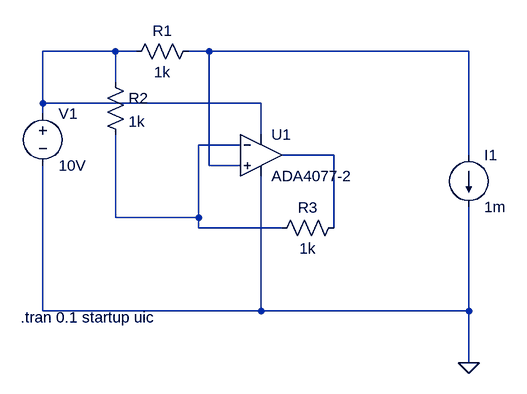
[diagram p0: schematic Draft7.asc]
Draft7.asc, the LTspice schematic file:
Version 4
SHEET 1 880 680
WIRE 160 32 48 32
WIRE 192 32 160 32
WIRE 304 32 272 32
WIRE 704 32 304 32
WIRE 160 80 160 32
WIRE 48 112 48 32
WIRE 384 112 48 112
WIRE 48 128 48 112
WIRE 384 160 384 112
WIRE 352 176 288 176
WIRE 496 192 416 192
WIRE 704 192 704 32
WIRE 304 208 304 32
WIRE 352 208 304 208
WIRE 160 288 160 160
WIRE 288 288 288 176
WIRE 288 288 160 288
WIRE 288 304 288 288
WIRE 416 304 288 304
WIRE 496 304 496 192
WIRE 48 432 48 208
WIRE 384 432 384 224
WIRE 384 432 48 432
WIRE 704 432 704 272
WIRE 704 432 384 432
WIRE 704 512 704 432
FLAG 704 512 0
SYMBOL voltage 48 112 R0
WINDOW 123 0 0 Left 0
WINDOW 39 0 0 Left 0
SYMATTR InstName V1
SYMATTR Value 10V
SYMBOL Opamps\\ADA4077-2 384 128 R0
SYMATTR InstName U1
SYMBOL res 288 16 R90
WINDOW 0 0 56 VBottom 2
WINDOW 3 32 56 VTop 2
SYMATTR InstName R1
SYMATTR Value 1k
SYMBOL current 704 192 R0
WINDOW 123 0 0 Left 0
WINDOW 39 0 0 Left 0
SYMATTR InstName I1
SYMATTR Value 1m
SYMBOL res 144 64 R0
SYMATTR InstName R2
SYMATTR Value 1k
SYMBOL res 512 288 R90
WINDOW 0 0 56 VBottom 2
WINDOW 3 32 56 VTop 2
SYMATTR InstName R3
SYMATTR Value 1k
TEXT 14 442 Left 2 !.tran 0.1 startup uic

The netlist it stands for:
* Draft7.asc
V1 N001 0 10V
XU1 N002 N003 N001 0 N004 ADA4077-2  ; pins In+ In- V+ V- OUT
R1 N002 N001 1k
I1 N002 0 1m
R2 N001 N003 1k
R3 N004 N003 1k
.tran 0.1 startup uic
.backanno
.end